# EasyEDA Pro project Marlin2SamplerWrapper.eprj

# Schematic Schematic1_2
Create Date: 2023-06-06; Page Name: P1; Project Name: Marlin2SamplerWrapper; Schematic Name: Schematic1_2; Update Date: 2023-06-06; Company: 嘉立创EDA; Page Size: A4; Version: V1.0
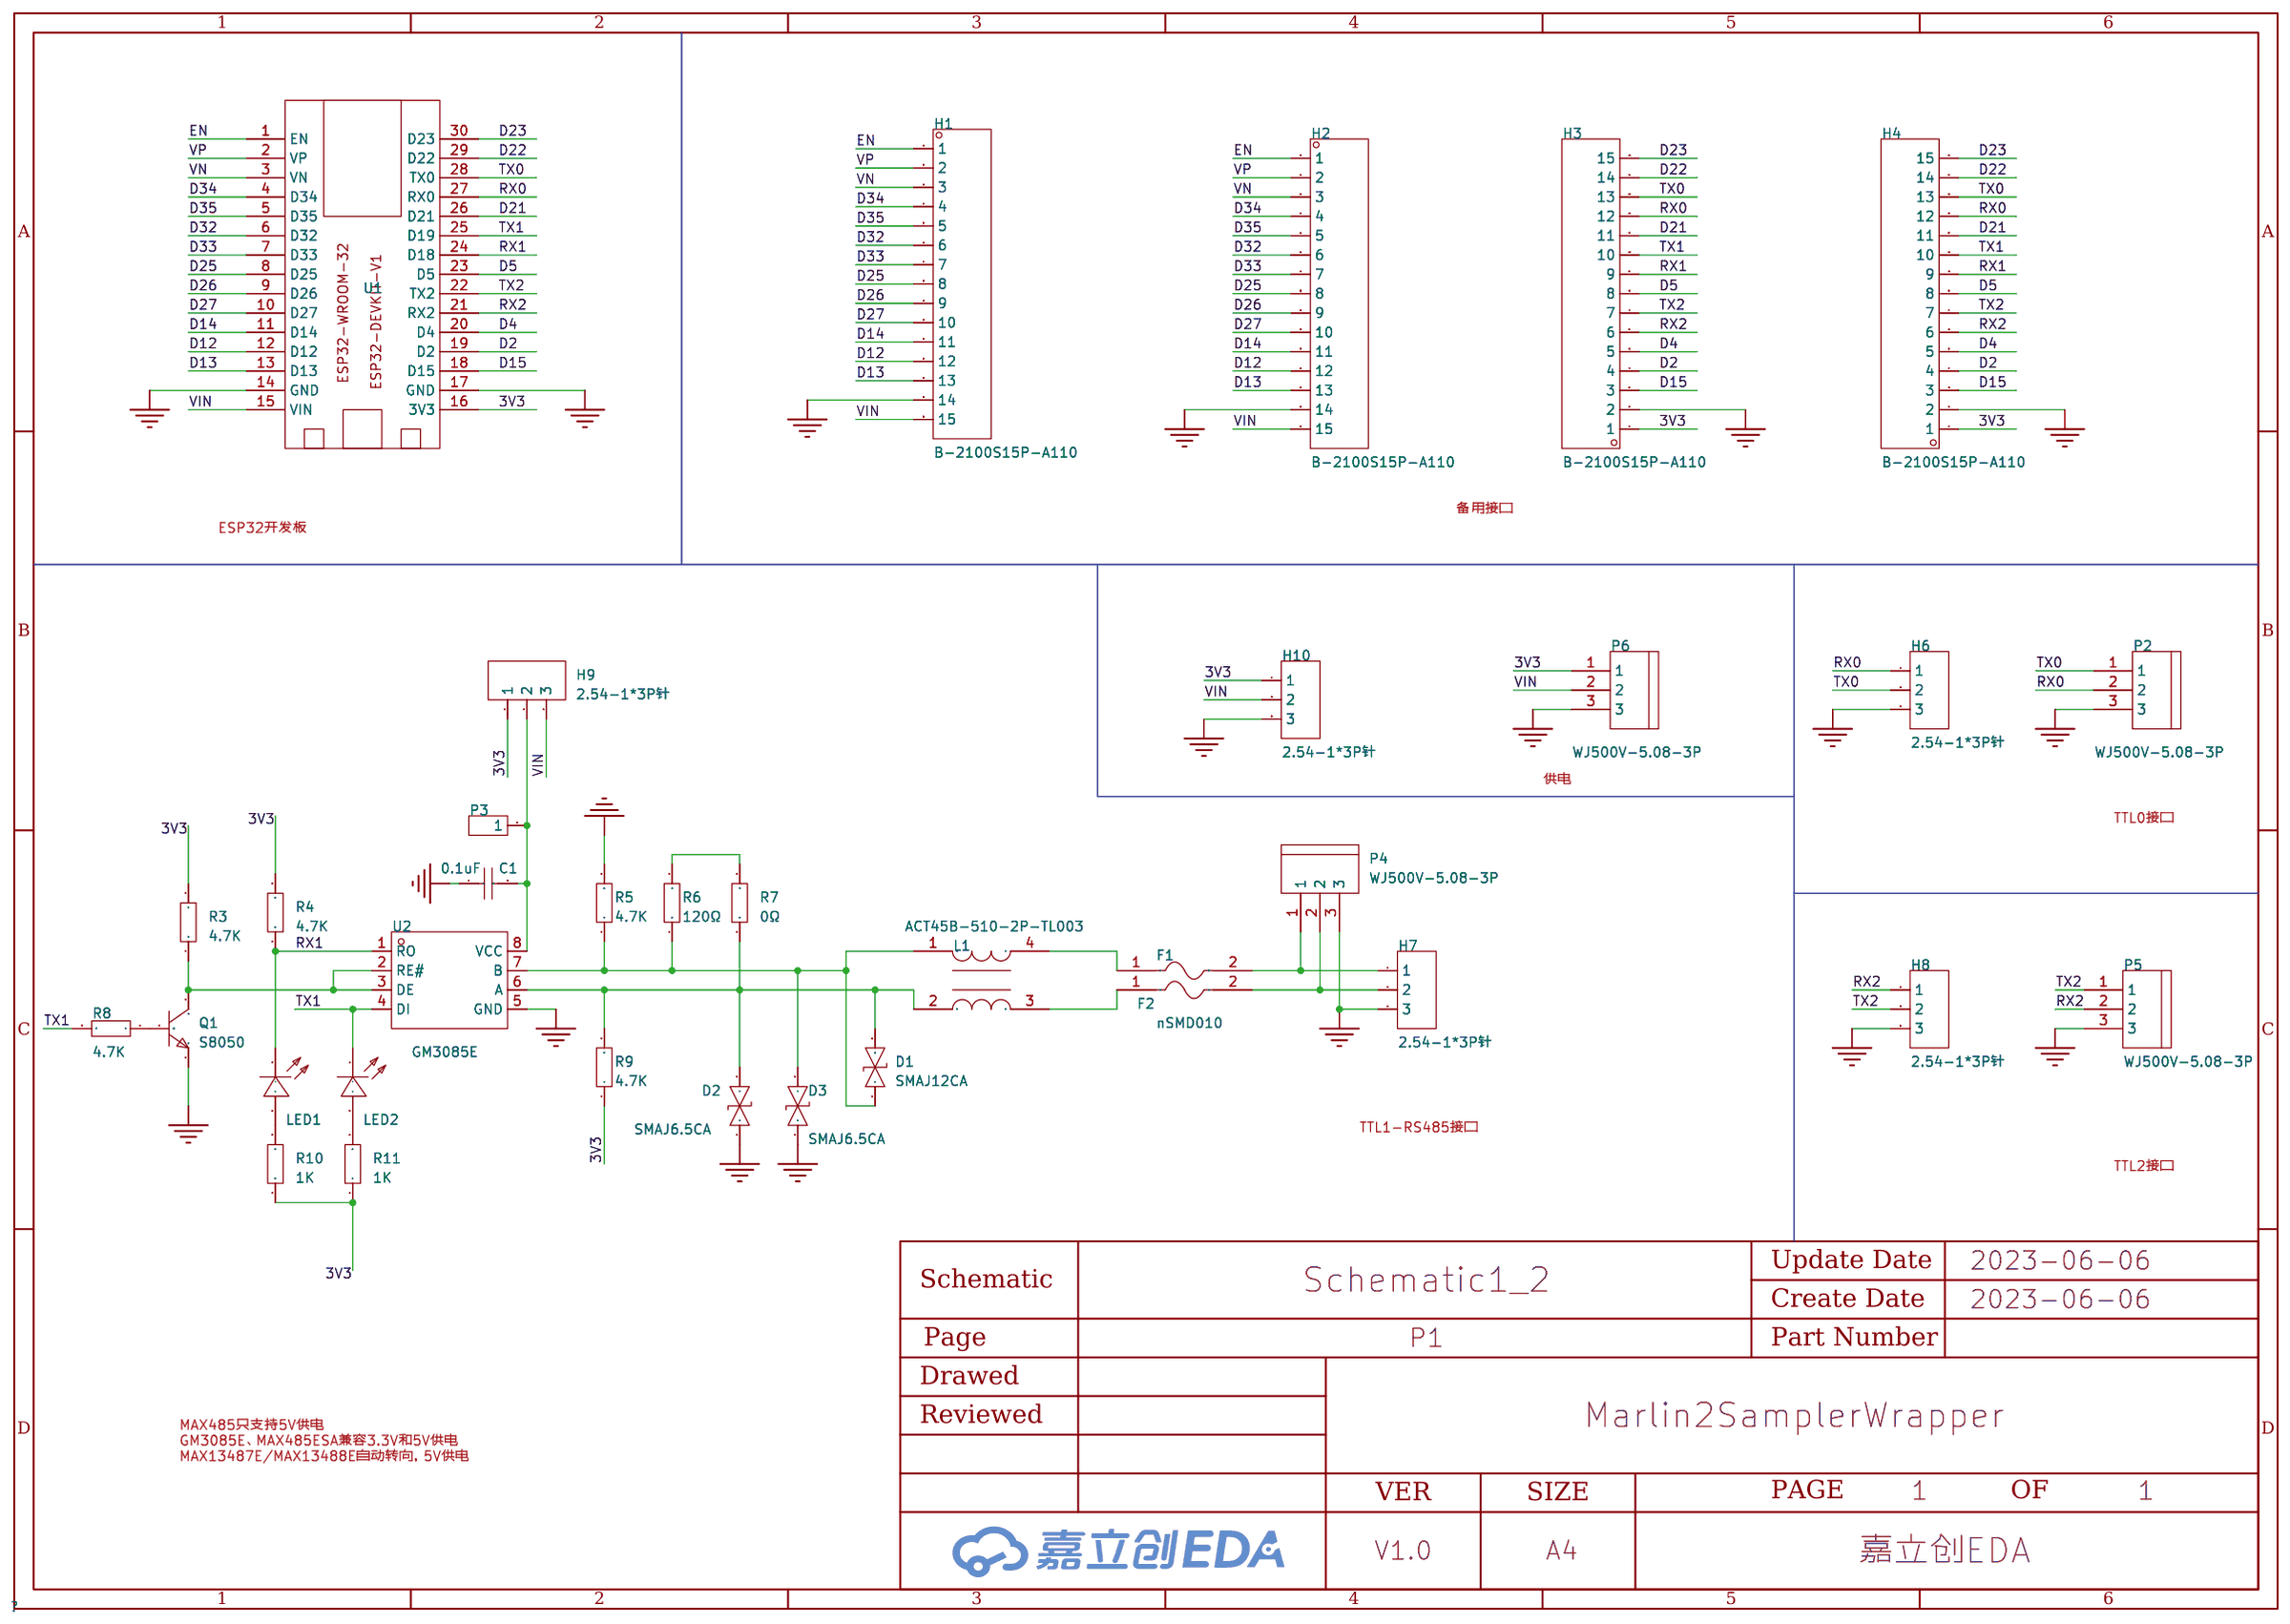
[diagram p0: schematic sheet]

## Parts
C1  0.1uF  [C0805]
D1  SMAJ12CA  [SMA_L4.4-W2.6-LS5.0-BI]
D2  SMAJ6.5CA  [SMA_L4.4-W2.6-LS5.0-BI]
D3  SMAJ6.5CA  [SMA_L4.4-W2.6-LS5.0-BI]
F1  nSMD010  [F1206]
F2  nSMD010  [F1206]
H1  B-2100S15P-A110  [HDR-TH_15P-P2.54-V-M]
H2  B-2100S15P-A110  [HDR-TH_15P-P2.54-V-M]
H3  B-2100S15P-A110  [HDR-TH_15P-P2.54-V-M]
H4  B-2100S15P-A110  [HDR-TH_15P-P2.54-V-M]
H6  2.54-1*3P针  [HDR-TH_3P-P2.54-V-M-1]
H7  2.54-1*3P针  [HDR-TH_3P-P2.54-V-M-1]
H8  2.54-1*3P针  [HDR-TH_3P-P2.54-V-M-1]
H9  2.54-1*3P针  [HDR-TH_3P-P2.54-V-M-1]
H10  2.54-1*3P针  [HDR-TH_3P-P2.54-V-M-1]
L1  ACT45B-510-2P-TL003  [IND-SMD_4P-L4.5-W3.2-TL]
LED1  NCD0805R1  [LED0805-RD_RED]
LED2  NCD0805R1  [LED0805-RD_RED]
P2  WJ500V-5.08-3P  [CONN-TH_3P-P5.00_WJ500V-5.08-3P]
P3  2.54-1*1P针  [HDR-TH_1P-P2.54-V-M]
P4  WJ500V-5.08-3P  [CONN-TH_3P-P5.00_WJ500V-5.08-3P]
P5  WJ500V-5.08-3P  [CONN-TH_3P-P5.00_WJ500V-5.08-3P]
P6  WJ500V-5.08-3P  [CONN-TH_3P-P5.00_WJ500V-5.08-3P]
Q1  S8050  [TO-92-3_L4.9-W3.7-P1.27-L]
R3  4.7K  [R0805]
R4  4.7K  [R0805]
R5  4.7K  [R0805]
R6  120Ω  [R0805]
R7  0Ω  [R0805]
R8  4.7K  [R0805]
R9  4.7K  [R0805]
R10  1K  [R0805]
R11  1K  [R0805]
U1  -  [ESP32-devkit-30pin]
U2  GM3085E  [SOP-8_L4.9-W3.9-P1.27-LS6.0-BL]

## Library data of the parts
C1 = CL21A106KOQNNNE: 容值:10uF;精度:±10%;额定电压:16V;材质(温度系数):X5R;; LCSC Part Name: 10uF ±10% 16V; Supplier Part: C1713; Manufacturer: SAMSUNG(三星); Supplier Footprint: 0805; JLCPCB Part Class: Extended Part; Datasheet: https://atta.szlcsc.com/upload/public/pdf/source/20160103/1457707694240.pdf; Supplier: LCSC; Tolerance: ±10%; Voltage Rated: 16V; Temperature Coefficient: X5R
D1 = SMAJ12CA_C110042: 极性:双向;反向截止电压(Vrwm):12V;击穿电压:13.3V;最大钳位电压:19.9V;; LCSC Part Name: 双向TVS 12V截止 20.1A峰值脉冲; Supplier Part: C110042; Manufacturer: MDD; Supplier Footprint: SMA(DO-214AC); JLCPCB Part Class: Extended Part; Datasheet: https://atta.szlcsc.com/upload/public/pdf/source/20230314/4319D8044EE29783A53F6AC60595AA71.pdf; Supplier: LCSC; Polarity: 双向; Reverse Stand-Off Voltage (Vrwm): 12V; Breakdown Voltage: 13.3V; Peak Pulse Current (Ipp)@10/1000μs: 20.1A; Maximum Clamping Voltage: 19.9V
D2 D3 = SMAJ6.5CA_C192922: 极性:双向;反向截止电压(Vrwm):6.5V;击穿电压:7.22V;最大钳位电压:11.2V;; LCSC Part Name: 双向 Vrwm:6.5V; Supplier Part: C192922; Manufacturer: 晶导微电子; Supplier Footprint: SMA(DO-214AC); JLCPCB Part Class: Extended Part; Datasheet: https://atta.szlcsc.com/upload/public/pdf/source/20180521/C192922_DE14EFAD4C80F9427B705159DBAF7B10.pdf; Supplier: LCSC; Polarity: 双向; Reverse Stand-Off Voltage (Vrwm): 6.5V; Breakdown Voltage: 7.22V; Peak Pulse Current (Ipp)@10/1000μs: 35.7A; Maximum Clamping Voltage: 11.2V
F1 F2 = nSMD010: 最大电压:60V;保持电流:100mA;最大电流:100A;跳闸电流:250mA;; LCSC Part Name: 0.1A  60V 自恢复保险丝; Supplier Part: C70065; Manufacturer: 台湾陆海; Supplier Footprint: 1206; JLCPCB Part Class: Extended Part; Datasheet: https://atta.szlcsc.com/upload/public/pdf/source/20160331/1459396375985.pdf; Supplier: LCSC; Operating Voltage (Max): 60V; Hold Current: 100mA; Current Rating (Max): 100A; Trip Current: 250mA
H1-H4 = B-2100S15P-A110: 排数:单排;总PIN位数:15;间距:2.54mm;插针结构:1x15P;行距:-;安装类型:直插;圆针/方针:-;额定电流:-;额定电压:-;配合针长度:6mm;塑高:2.54mm;端接针长度:3mm;触头材质:黄铜;触头镀层:-;工作温度范围:-40℃~+105℃;颜色:黑色;; LCSC Part Name: 2.54mm 1x15P 直插; Supplier Part: C124373; Manufacturer: Ckmtw(灿科盟); Supplier Footprint: 插件,P=2.54mm; JLCPCB Part Class: Extended Part; Datasheet: https://atta.szlcsc.com/upload/public/pdf/source/20170821/C124373_1503303304753901525.pdf; Supplier: LCSC; Number of Rows: 单排; Number of Pins: 15; Pitch: 2.54mm; Pin Structure: 1x15P; Mounting Type: 直插; Length of Mating Pin: 6mm; Insulation Height: 2.54mm; Length of End Connection Pin: 3mm; Contact Material: 黄铜; Operating Temperature Range: -40℃~+105℃; Color: 黑色
H6-H10 = 2.54-1*3P针: 排数:单排;总PIN位数:3;间距:2.54mm;插针结构:1x3P;行距:-;安装类型:直插;圆针/方针:方针;额定电流:3A;额定电压:-;配合针长度:-;塑高:-;端接针长度:-;触头材质:-;触头镀层:-;工作温度范围:-40℃~+105℃;颜色:黑色;; LCSC Part Name: 2.54mm 1x3P 直插 方针; Supplier Part: C49257; Manufacturer: BOOMELE(博穆精密); Supplier Footprint: 插件,P=2.54mm; JLCPCB Part Class: Extended Part; Datasheet: https://atta.szlcsc.com/upload/public/pdf/source/20221018/3E9408392E35E6F57A28985E5F7BF5C9.pdf; Supplier: LCSC; Number of Rows: 单排; Number of Pins: 3; Pitch: 2.54mm; Pin Structure: 1x3P; Mounting Type: 直插; Circluar Pins/Square Pins: 方针; Current Rating (Max): 3A; Operating Temperature Range: -40℃~+105℃; Color: 黑色
L1 = ACT45B-510-2P-TL003: 线路数:2;阻抗 @ 频率:2.8kΩ@10MHz;电感 @ 频率:51uH@100kHz;直流电阻(DCR):1Ω;; LCSC Part Name: 两路 4532共模滤波器 阻抗2.8kΩ@10MHz; Supplier Part: C76584; Manufacturer: TDK; Supplier Footprint: 4532; JLCPCB Part Class: Extended Part; Datasheet: https://atta.szlcsc.com/upload/public/pdf/source/20160918/1474166842057.pdf; Supplier: LCSC; Number of Lines: 2; Impedance @ Frequency: 2.8kΩ@10MHz; Inductance @ Frequency: 51uH@100kHz; Current Rating: 200mA; DC Resistance (DCR): 1Ω; Voltage Rating - DC: 50V; Operating Temperature: -40℃~+150℃; Withstanding Voltage: 250V@2Secs
LED1 LED2 = NCD0805R1: 发光颜色:红灯;; LCSC Part Name: 红灯; Supplier Part: C84256; Manufacturer: 国星光电; Supplier Footprint: 0805; JLCPCB Part Class: Basic Part; Datasheet: https://atta.szlcsc.com/upload/public/pdf/source/20200820/C84256_F0A75A43B3EAD75808600A0514C76B99.pdf; Supplier: LCSC; Emitted Color: 红灯
P2 P4-P6 = WJ500V-5.08-3P: 间距:5.08mm;结构:1x3P;排数:1;每排PIN数:3;安装方式:直针;额定电流:18A;额定电压:250V;线规 - AWG:14~30;线规 - mm2:2.5;工作温度范围:-40℃~+105℃;颜色:绿色;; LCSC Part Name: 5.08mm 1x3P 排数:1 每排P数:3 直针 可拼接; Supplier Part: C72334; Manufacturer: KANGNEX(康奈克斯电气); Supplier Footprint: 插件,P=5.08mm; JLCPCB Part Class: Extended Part; Datasheet: https://atta.szlcsc.com/upload/public/pdf/source/20191225/C72334_8A5EF831D67650233B6B1E3F2BC06274.pdf; Supplier: LCSC; Pitch: 5.08mm; Structure: 1x3P; Number of Rows: 1; Number of PINs Per Row: 3; Mounting Style: 直针; Current Rating (Max): 18A; Voltage Rating (Max): 250V; Wire Gauge - AWG: 14~30; Wire Gauge - mm2: 2.5; Operating Temperature Range: -40℃~+105℃; Color: 绿色
P3 = 2.54-1*1P针: 排数:单排;总PIN位数:1;间距:-;插针结构:-;行距:-;安装类型:直插;圆针/方针:-;额定电流:-;额定电压:-;配合针长度:-;塑高:-;触头材质:-;触头镀层:-;颜色:黑色;; LCSC Part Name: 直插; Supplier Part: C81276; Manufacturer: BOOMELE(博穆精密); Supplier Footprint: 插件,P=2.54mm; JLCPCB Part Class: Extended Part; Datasheet: https://atta.szlcsc.com/upload/public/pdf/source/20221018/3E9408392E35E6F57A28985E5F7BF5C9.pdf; Supplier: LCSC; Number of Rows: 单排; Number of Pins: 1; Mounting Type: 直插; Color: 黑色
Q1 = S8050_C8327: 晶体管类型:NPN;集射极击穿电压(Vceo):25V;集电极电流(Ic):500mA;功率(Pd):625mW;集电极截止电流(Icbo):100nA;集电极-发射极饱和电压(VCE(sat)@Ic,Ib):600mV@500mA,50mA;直流电流增益(hFE@Ic,Vce):160@50mA,1V;特征频率(fT):150MHz;工作温度:+150℃@(Tj);; LCSC Part Name: NPN 25V 500mA; Supplier Part: C8327; Manufacturer: CJ(江苏长电/长晶); Supplier Footprint: TO-92-3; JLCPCB Part Class: Extended Part; Datasheet: https://atta.szlcsc.com/upload/public/pdf/source/20130521/1457706603998.pdf; Supplier: LCSC; Transistor Type: NPN; Collector-Emitter Breakdown Voltage (Vceo): 25V; Collector Current (Ic): 500mA; Power Dissipation (Pd): 625mW; Collector Cut-Off Current (Icbo): 100nA; Collector-Emitter Saturation Voltage (VCE(sat)@Ic,Ib): 600mV@500mA,50mA; DC Current Gain (hFE@Ic,Vce): 160@50mA,1V; Transition Frequency (fT): 150MHz; Operating Temperature: +150℃@(Tj)
R3 R4 R8 R10 R11 = Res_0805: Supplier Footprint: 0805
R5 R6 R9 = 0805W8F1200T5E: 电阻类型:厚膜电阻;阻值:120Ω;精度:±1%;功率:125mW;; LCSC Part Name: 120Ω ±1% 125mW; Supplier Part: C17437; Manufacturer: UNI-ROYAL(厚声); Supplier Footprint: 0805; JLCPCB Part Class: Basic Part; Datasheet: https://atta.szlcsc.com/upload/public/pdf/source/20200306/C422600_1E6D84923E4A46A82E41ADD87F860B5C.pdf; Supplier: LCSC; Type: 厚膜电阻; Tolerance: ±1%; Power(Watts): 125mW; Temperature Coefficient: ±100ppm/℃; Overload Voltage (Max): 150V; Operating Temperature Range: -55℃~+155℃
R7 = 0805W8F0000T5E: 电阻类型:厚膜电阻;阻值:0Ω;精度:±1%;功率:125mW;; LCSC Part Name: 0Ω ±1% 125mW; Supplier Part: C17477; Manufacturer: UNI-ROYAL(厚声); Supplier Footprint: 0805; JLCPCB Part Class: Basic Part; Datasheet: https://atta.szlcsc.com/upload/public/pdf/source/20200306/C422600_1E6D84923E4A46A82E41ADD87F860B5C.pdf; Supplier: LCSC; Type: 厚膜电阻; Tolerance: ±1%; Power(Watts): 125mW; Temperature Coefficient: ±800ppm/℃; Overload Voltage (Max): 150V; Operating Temperature Range: -55℃~+155℃
U1 = ESP32-DEVKIT-V1(30pin): 淘宝上卖的ESP32开发板，大多数是30脚的这一款
U2 = GM3085E: 类型:收发器;驱动器/接收器:1/1;数据速率:1Mbps;; LCSC Part Name: 3V~5.5V供电 1Mbps 收发器; Supplier Part: C269864; Manufacturer: GATEMODE(捷茂微); Supplier Footprint: SOP-8; JLCPCB Part Class: Extended Part; Datasheet: https://atta.szlcsc.com/upload/public/pdf/source/20180903/C269864_EB56873CBCC7049A9A506FCD98F69E64.pdf; Supplier: LCSC; Types: 收发器; Driver/receiver: 1/1; Data Rate: 1Mbps; Supply Voltage: 3V~5.5V

## Nets
3V3: H3.1 H4.1 H9.1 H10.1 P6.1 R3.2 R4.2 R9.1 R10.1 R11.1 U1.16(3V3)
GND: C1.1 D2.1(K) D3.1(K) H1.14 H2.14 H3.2 H4.2 H6.3 H7.3 H8.3 H10.3 P2.3 P4.3 P5.3 P6.3 Q1.1(E) R5.2 U1.14(GND) U1.17(GND) U2.5(GND)
VIN: H1.15 H2.15 H9.3 H10.2 P6.2 U1.15(VIN)
D2: H3.4 H4.4 U1.19(D2)
D4: H3.5 H4.5 U1.20(D4)
D5: H3.8 H4.8 U1.23(D5)
D12: H1.12 H2.12 U1.12(D12)
D13: H1.13 H2.13 U1.13(D13)
D14: H1.11 H2.11 U1.11(D14)
D15: H3.3 H4.3 U1.18(D15)
D21: H3.11 H4.11 U1.26(D21)
D22: H3.14 H4.14 U1.29(D22)
D23: H3.15 H4.15 U1.30(D23)
D25: H1.8 H2.8 U1.8(D25)
D26: H1.9 H2.9 U1.9(D26)
D27: H1.10 H2.10 U1.10(D27)
D32: H1.6 H2.6 U1.6(D32)
D33: H1.7 H2.7 U1.7(D33)
D34: H1.4 H2.4 U1.4(D34)
D35: H1.5 H2.5 U1.5(D35)
EN: H1.1 H2.1 U1.1(EN)
RX0: H3.12 H4.12 H6.1 P2.2 U1.27(RX0)
RX1: H3.9 H4.9 LED1.1(-) R4.1 U1.24(D18) U2.1(RO)
RX2: H3.6 H4.6 H8.1 P5.2 U1.21(RX2)
TX0: H3.13 H4.13 H6.2 P2.1 U1.28(TX0)
TX1: H3.10 H4.10 LED2.1(-) R8.2 U1.25(D19) U2.4(DI)
TX2: H3.7 H4.7 H8.2 P5.1 U1.22(TX2)
VN: H1.3 H2.3 U1.3(VN)
VP: H1.2 H2.2 U1.2(VP)
$1N2909: Q1.3(C) R3.1 U2.2(RE#) U2.3(DE)
$1N4480: Q1.2(B) R8.1
$1N4547: R6.2 R7.2
$1N4912: F2.2 H7.2 P4.2
$1N4918: F1.2 H7.1 P4.1
$1N5168: C1.2 H9.2 P3.1 U2.8(VCC)
$1N5254: D1.1 D3.2(A) L1.1 R5.1 R6.1 U2.7(B)
$1N5258: D1.2 D2.2(A) L1.2 R7.1 R9.2 U2.6(A)
$1N5262: F1.1 L1.4
$1N5266: F2.1 L1.3
$1N5324: LED2.2(+) R11.2
$1N5326: LED1.2(+) R10.2

## Notes on the sheet
- 备用接口
- ESP32开发板
- 供电
- TTL0接口
- TTL1-RS485接口
- TTL2接口
- MAX485只支持5V供电
  GM3085E、MAX485ESA兼容3.3V和5V供电
  MAX13487E/MAX13488E自动转向，5V供电

# Schematic Schematic2_1
Create Date: 2023-06-06; Page Name: P1; Project Name: Marlin2SamplerWrapper; Schematic Name: Schematic2; Update Date: 2023-06-06; Company: 嘉立创EDA; Page Size: A4; Version: V1.0
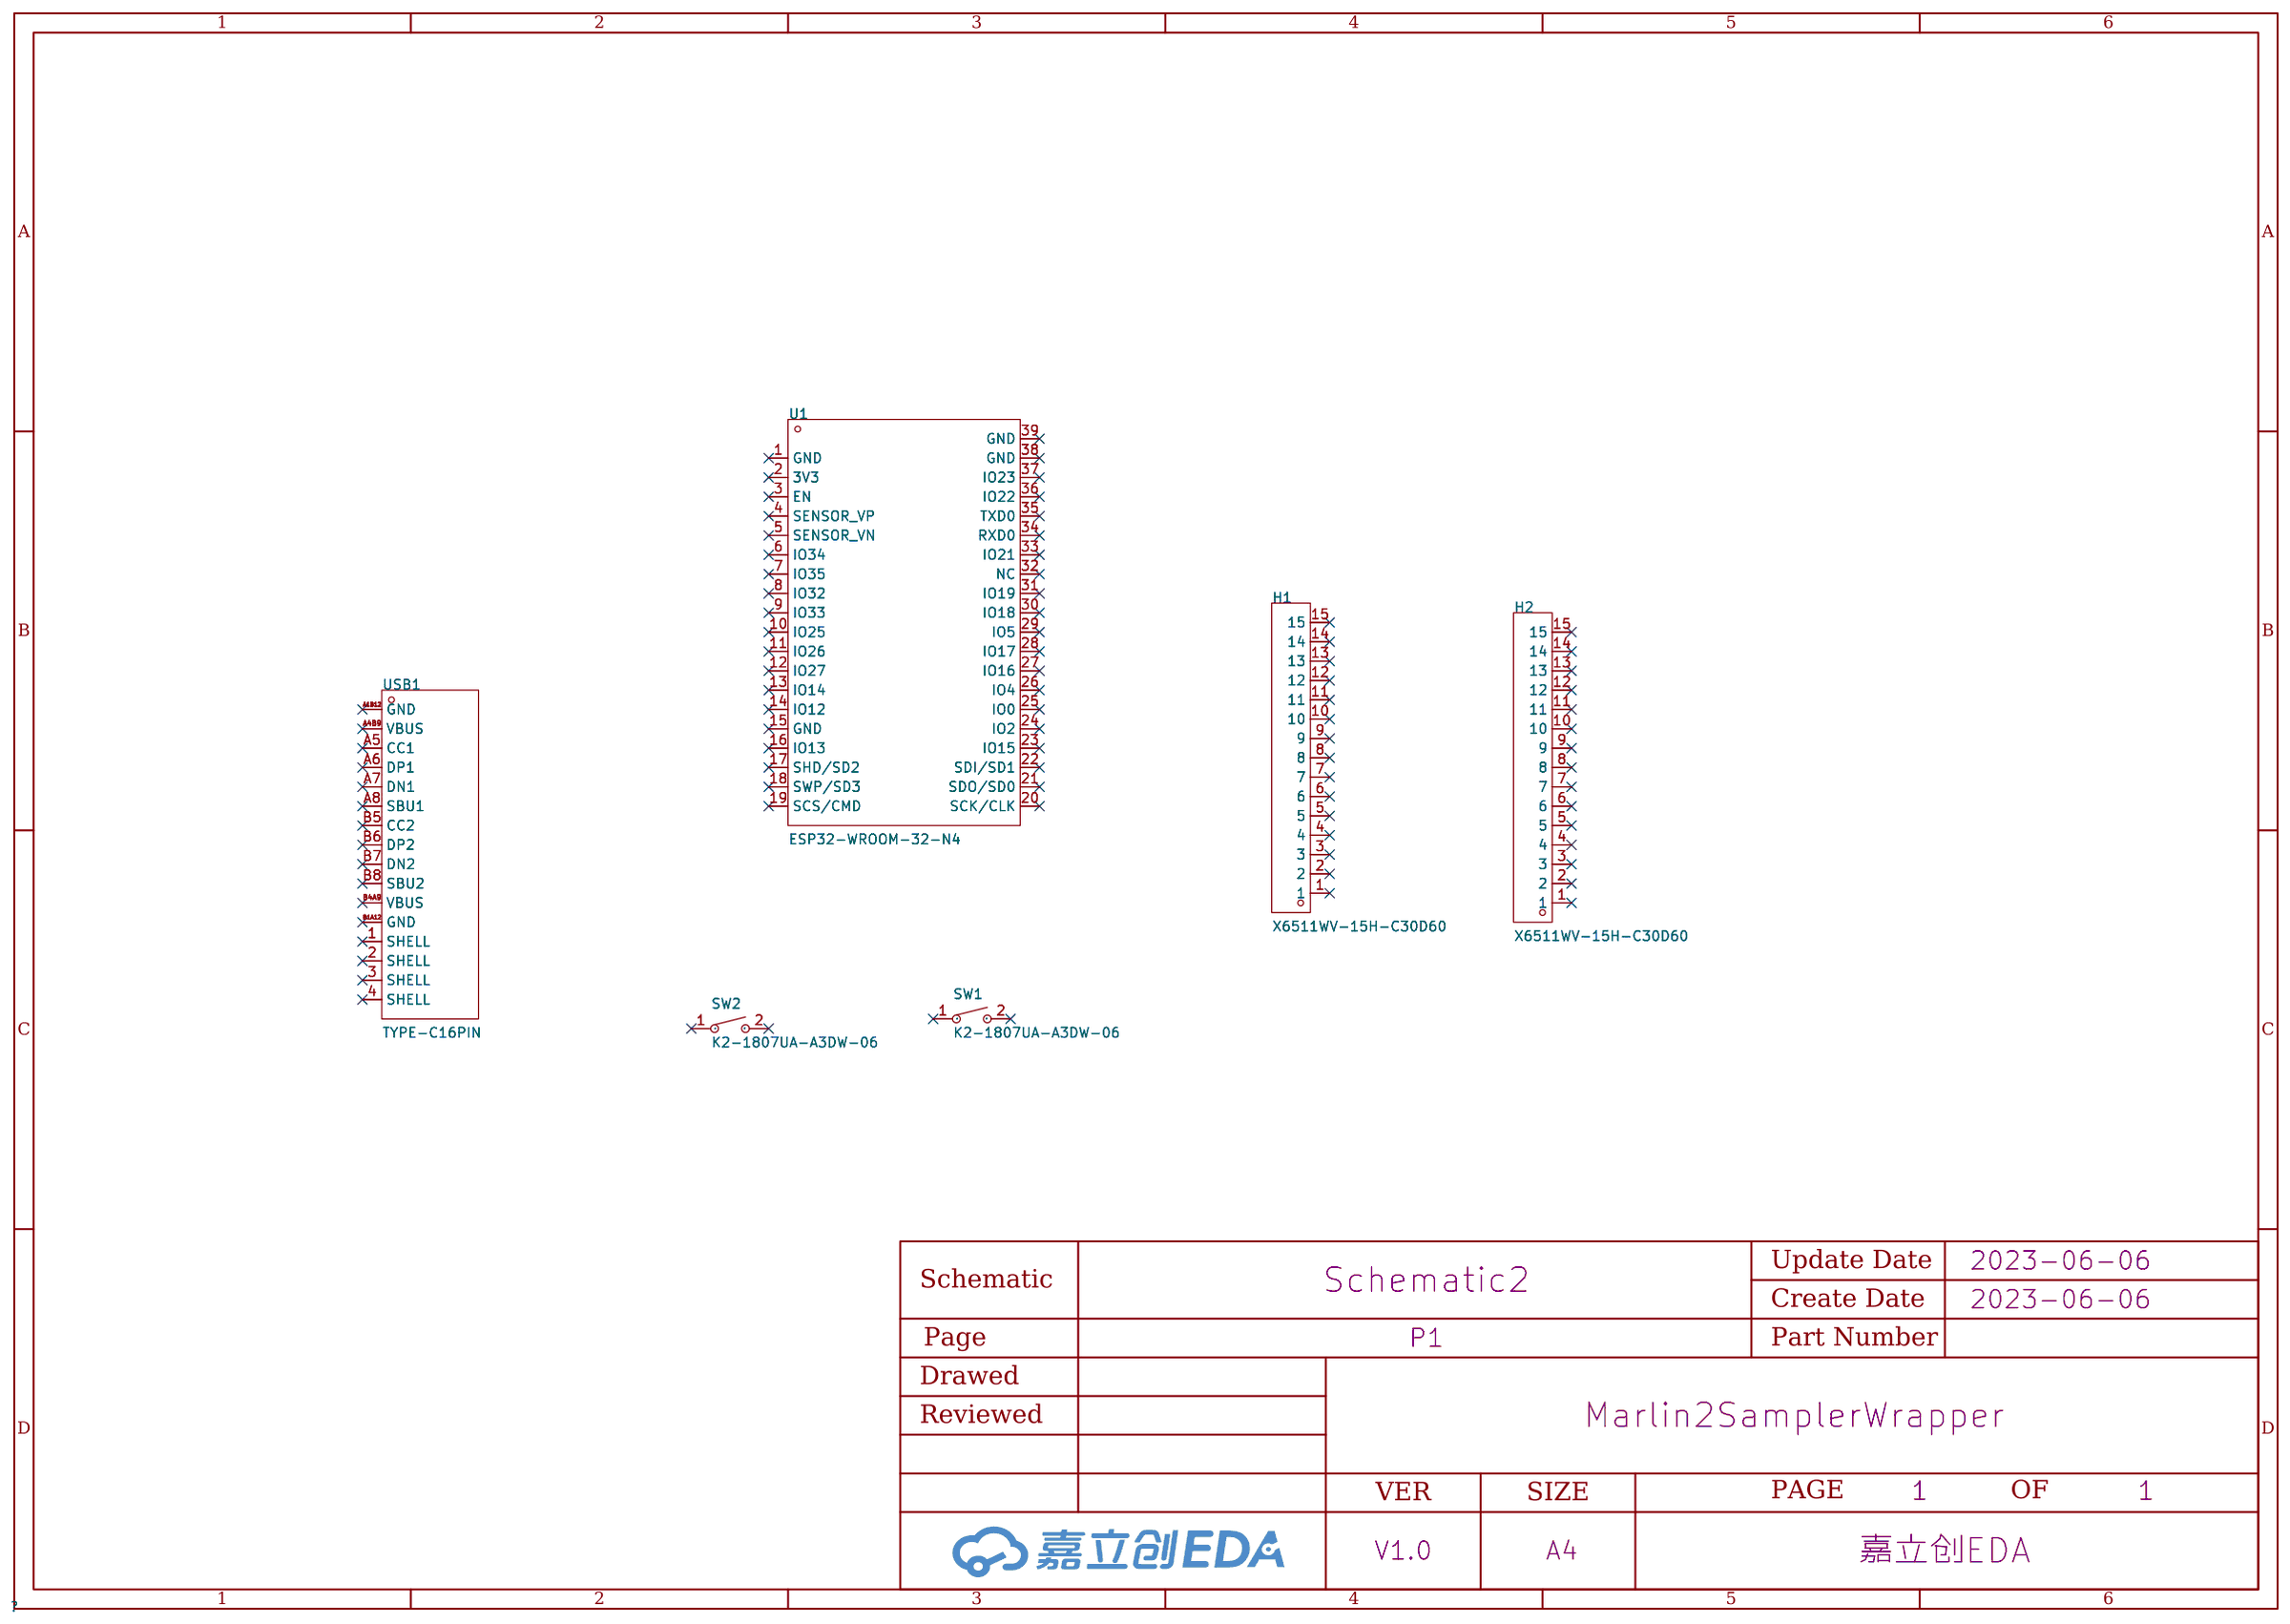
[diagram p1: schematic sheet]

## Parts
H1  X6511WV-15H-C30D60  [HDR-TH_15P-P2.54-V-M]
H2  X6511WV-15H-C30D60  [HDR-TH_15P-P2.54-V-M]
SW1  K2-1807UA-A3DW-06  [KEY-SMD_L4.0-W2.9-L]
SW2  K2-1807UA-A3DW-06  [KEY-SMD_L4.0-W2.9-L]
U1  ESP32-WROOM-32-N4  [WIFIM-SMD_ESP32-WROOM-32-N4]
USB1  TYPE-C16PIN  [USB-C-SMD_TYPE-C16PIN]

## Library data of the parts
H1 H2 = X6511WV-15H-C30D60: 排数:单排;总PIN位数:15;间距:2.54mm;插针结构:1x15P;行距:-;安装类型:直插;圆针/方针:方针;额定电流:3A;额定电压:250V;配合针长度:6mm;塑高:2.5mm;端接针长度:3mm;触头材质:黄铜;触头镀层:金;工作温度范围:-40℃~+105℃;焊接温度(最大值):260℃;颜色:黑色;; LCSC Part Name: 2.54mm1x15P直插方针; Supplier Part: C725947; Manufacturer: XKBConnectivity(中国星坤); Supplier Footprint: 插件,P=2.54mm; JLCPCB Part Class: ExtendedPart; Datasheet: https://atta.szlcsc.com/upload/public/pdf/source/20211009/D19569EFFEB9776B42364DF7D41FD96A.pdf; Supplier: LCSC; Number of Rows: 单排; Number of Pins: 15; Pitch: 2.54mm; Pin Structure: 1x15P; Mounting Type: 直插; Circluar Pins/Square Pins: 方针; Current Rating (Max): 3A; Voltage Rating (Max): 250V; Length of Mating Pin: 6mm; Insulation Height: 2.5mm; Length of End Connection Pin: 3mm; Contact Material: 黄铜; Contact Plating: 金; Operating Temperature Range: -40℃~+105℃; Welding Temperature (Max): 260℃; Color: 黑色
SW1 SW2 = K2-1807UA-A3DW-06: 触点电流:50mA;额定电压(DC):12V;绝缘电阻:100MΩ;电路结构:单刀单掷;安装方式:立贴;按钮形状:圆形按钮;带灯:-;作用力:180gf@±30gf;机械寿命:100000;工作温度:-25℃~+85℃;开关长度:4mm;开关宽度:2.9mm;开关高度:2mm;; LCSC Part Name: 3x4x2.0包脚U型; Supplier Part: C502308; Manufacturer: 韩国韩荣; Supplier Footprint: SMD; JLCPCB Part Class: ExtendedPart; Datasheet: https://atta.szlcsc.com/upload/public/pdf/source/20200331/C502307_15C9B93D30C058C4B615B227891823AA.pdf; Supplier: LCSC; Contact Current: 50mA; Voltage Rating (DC): 12V; Insulation Resistance: 100MΩ; Circuit: 单刀单掷; Mounting Sytle: 立贴; Actuator Style: 圆形按钮; Operating Force: 180gf@±30gf; Mechanical Life: 100000; Operating Temperature: -25℃~+85℃; Switch Length: 4mm; Switch Width: 2.9mm; Switch Height: 2mm
U1 = ESP32-WROOM-32-N4: WiFi+蓝牙4.2+双核CPU,ESP32; Supplier Part: C82899; Manufacturer: ESPRESSIF(乐鑫); Supplier Footprint: WIFI无线Module; JLCPCB Part Class: ExtendedPart; Datasheet: https://atta.szlcsc.com/upload/public/pdf/source/20210719/C82899_2D52724B6FAFABC419BCF308C5944296.pdf; Supplier: LCSC
USB1 = TYPE-C16PIN: 连接器类型:Type-C;标准:-;公母:母座;触点数量:16;端口数量:1;安装方式:卧贴;额定电流-电源:3A;工作温度范围:-40℃~+85℃;; LCSC Part Name: Type-C母座卧贴快充闪充停产; Supplier Part: C393939; Manufacturer: SHOUHAN(首韩); Supplier Footprint: SMD; JLCPCB Part Class: ExtendedPart; Datasheet: https://atta.szlcsc.com/upload/public/pdf/source/20190521/C393939_7B9043D4CF1026AF443AB60D91FBCD5C.pdf; Supplier: LCSC; Connector Type: Type-C; Gender: 母座; Number of Contacts: 16; Number of Ports: 1; Mounting Style: 卧贴; Current Rating - Power (Max): 3A; Operating Temperature Range: -40℃~+85℃

## Nets

Not connected (* = marked no-connect by the designer): H1 1* 2* 3* 4* 5* 6* 7* 8* 9* 10* 11* 12* 13* 14* 15*; H2 1* 2* 3* 4* 5* 6* 7* 8* 9* 10* 11* 12* 13* 14* 15*; SW1 1* 2*; SW2 1* 2*; U1 1(GND)* 2(3V3)* 3(EN)* 4(SENSOR_VP)* 5(SENSOR_VN)* 6(IO34)* 7(IO35)* 8(IO32)* 9(IO33)* 10(IO25)* 11(IO26)* 12(IO27)* 13(IO14)* 14(IO12)* 15(GND)* 16(IO13)* 17(SHD/SD2)* 18(SWP/SD3)* 19(SCS/CMD)* 20(SCK/CLK)* 21(SDO/SD0)* 22(SDI/SD1)* 23(IO15)* 24(IO2)* 25(IO0)* 26(IO4)* 27(IO16)* 28(IO17)* 29(IO5)* 30(IO18)* 31(IO19)* 32(NC)* 33(IO21)* 34(RXD0)* 35(TXD0)* 36(IO22)* 37(IO23)* 38(GND)* 39(GND)*; USB1 1(SHELL)* 2(SHELL)* 3(SHELL)* 4(SHELL)* A1B12(GND)* A4B9(VBUS)* A5(CC1)* A6(DP1)* A7(DN1)* A8(SBU1)* B1A12(GND)* B4A9(VBUS)* B5(CC2)* B6(DP2)* B7(DN2)* B8(SBU2)*

# Board PCB11
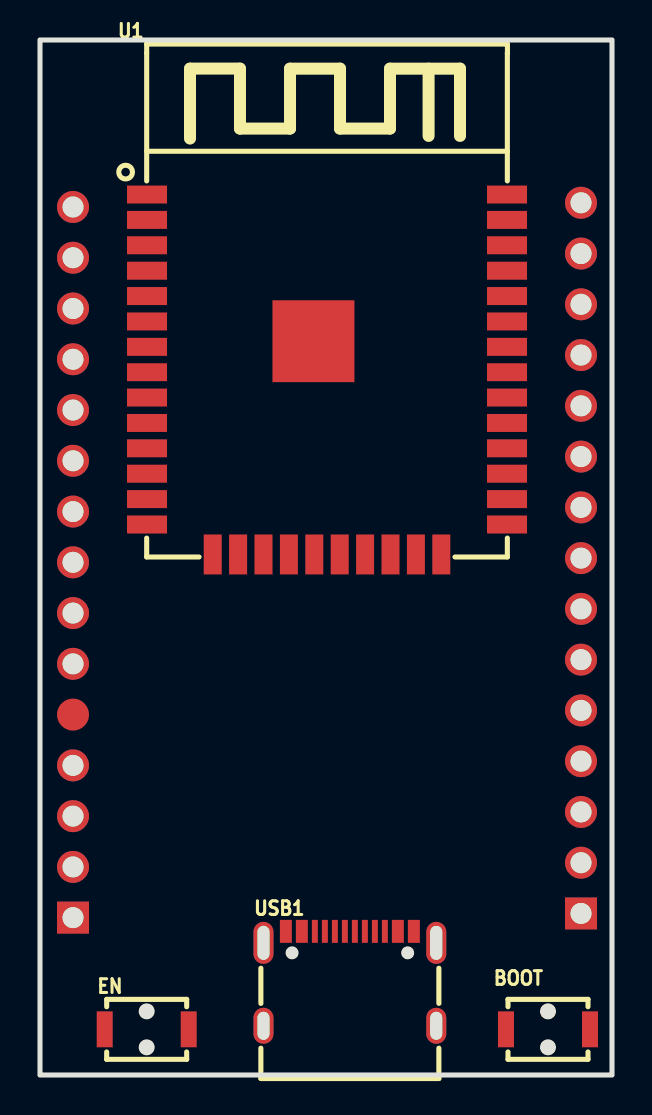
[diagram p2: board, top side]
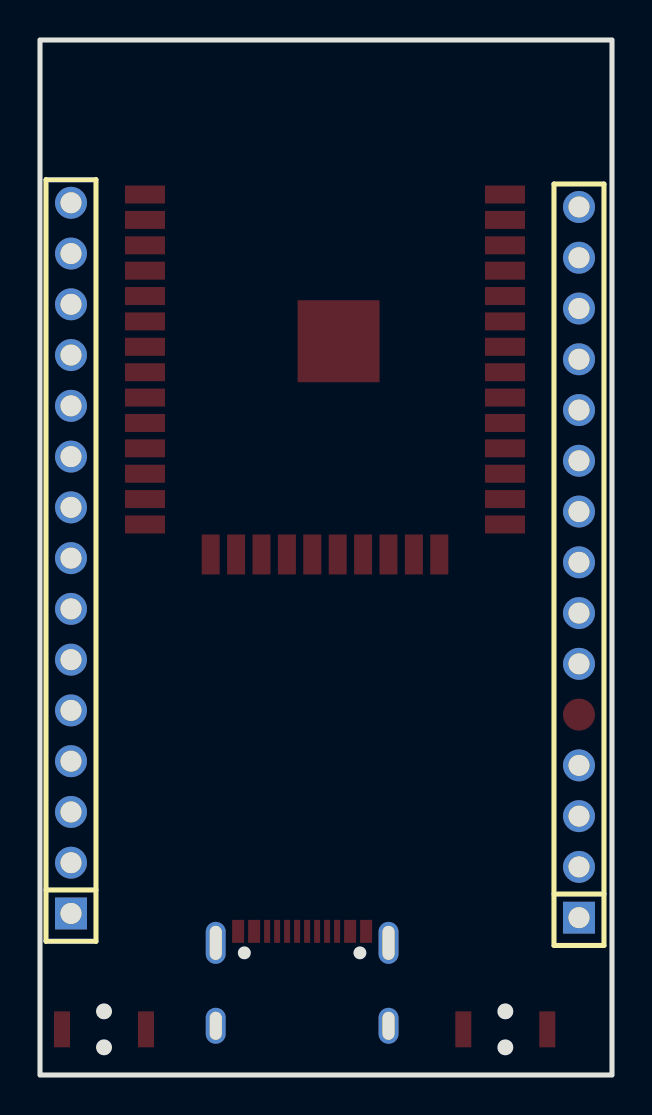
[diagram p3: board, bottom side, seen from below]

Outline 28.6 x 51.79 mm; copper layers: Top Layer, Bottom Layer. Coordinates in mm from the lower left corner of the outline.
Outline path: rectangle 0,51.79 28.6,0
Stack: Top Layer 0.035mm / Dielectric1 1.51mm FR4 er 4.5 / Bottom Layer 0.035mm

## Design rules (mm)
template: JLCPCB Capability(Two Layers Board)
spacing copperThickness1oz (default): track to track 0.102, other pairs 0.152 to 0.3
spacing copperThickness2oz: track to track 0.203, other pairs 0.152 to 0.3
track width copperThickness1oz (default): min 0.127, default 0.254, max 2.54
track width copperThickness2oz: min 0.203, default 0.254, max 2.54
differential pair differentialPair (default): width min 0.127, default 0.254, max 2.54; gap min 0.152, default 0.152
via viaSize (default): diameter min 0.5, default 0.61, max 10; hole min 0.3, default 0.305, max 6.3

## Placement (name value [footprint] x y rotation side)
BOOT  -  [KEY-SMD_L4.0-W2.9-L]  25.4 2.29 0 top
EN  -  [KEY-SMD_L4.0-W2.9-L]  5.33 2.29 0 top
H1  X6511WV-15H-C30D60  [hdr-th_15p-p2.54-v-m]  1.65 25.65 90 bottom
H2  X6511WV-15H-C30D60  [HDR-TH_15P-P2.54-V-M]  27.05 25.86 90 bottom
U1  ESP32-WROOM-32-N4  [WIFIM-SMD_ESP32-WROOM-32-N4]  14.35 35.05 0 top
USB1  TYPE-C16PIN  [USB-C-SMD_TYPE-C16PIN]  15.49 4.83 0 top

## Footprints (pads in the part's own frame, mm; a bottom-side part is the same pattern mirrored in y, then rotated)
HDR-TH_15P-P2.54-V-M
  rect 1.6x1.6 hole 1.05: 1(-17.78,0)
  round 1.6 hole 1.05: 2(-15.24,0) 3(-12.7,0) 4(-10.16,0) 5(-7.62,0) 6(-5.08,0) 7(-2.54,0) 8(0,0) 9(2.54,0) 10(5.08,0) 11(7.62,0) 12(10.16,0) 13(12.7,0) 14(15.24,0) 15(17.78,0)
hdr-th_15p-p2.54-v-m
  rect 1.6x1.6 hole 1.05: 1(-17.78,0)
  round 1.6 hole 1.05: 2(-15.24,0) 3(-12.7,0) 4(-10.16,0) 6(-5.08,0) 7(-2.54,0) 8(0,0) 9(2.54,0) 10(5.08,0) 11(7.62,0) 12(10.16,0) 13(12.7,0) 14(15.24,0) 15(17.78,0)
  round 1.6 smd far side: 5(-7.62,0)
KEY-SMD_L4.0-W2.9-L
  rect 0.8x1.8 smd: 1(-2.1,0) 2(2.1,0)
USB-C-SMD_TYPE-C16PIN
  oval 1x2.1 hole 0.6x1.7: 1(-4.32,1.788) 2(4.32,1.788)
  oval 1x1.8 hole 0.6x1.4: 3(-4.32,-2.362) 4(4.32,-2.362)
  rect 0.6x1.15 smd: A1B12(-3.2,2.362) A4B9(-2.4,2.362) B1A12(3.2,2.362) B4A9(2.4,2.362)
  rect 0.3x1.15 smd: A5(-1.25,2.362) A6(-0.25,2.362) A7(0.25,2.362) A8(-1.75,2.362) B5(1.75,2.362) B6(0.75,2.362) B7(-0.75,2.362) B8(1.25,2.362)
WIFIM-SMD_ESP32-WROOM-32-N4
  rect 2x0.9 smd: 1(-9,9.005) 2(-9,7.735) 3(-9,6.465) 4(-9,5.195) 5(-9,3.925) 6(-9,2.655) 7(-9,1.385) 8(-9,0.115) 9(-9,-1.155) 10(-9,-2.425) 11(-9,-3.695) 12(-9,-4.965) 13(-9,-6.235) 14(-9,-7.505) 25(9,-7.505) 26(9,-6.235) 27(9,-4.965) 28(9,-3.695) 29(9,-2.425) 30(9,-1.155) 31(9,0.115) 32(9,1.385) 33(9,2.655) 34(9,3.925) 35(9,5.195) 36(9,6.465) 37(9,7.735) 38(9,9.005)
  rect 0.9x2 smd: 15(-5.715,-9.005) 16(-4.445,-9.005) 17(-3.175,-9.005) 18(-1.905,-9.005) 19(-0.635,-9.005) 20(0.635,-9.005) 21(1.905,-9.005) 22(3.175,-9.005) 23(4.445,-9.005) 24(5.715,-9.005)
  rect 4.1x4.1 smd: 39(-0.68,1.665)

## Nets
As in the schematic.

Pads without a net: BOOT 1 2; EN 1 2; H1 1 2 3 4 5 6 7 8 9 10 11 12 13 14 15; H2 1 2 3 4 5 6 7 8 9 10 11 12 13 14 15; U1 1 2 3 4 5 6 7 8 9 10 11 12 13 14 15 16 17 18 19 20 21 22 23 24 25 26 27 28 29 30 31 32 33 34 35 36 37 38 39; USB1 1 2 3 4 A1B12 A4B9 A5 A6 A7 A8 B1A12 B4A9 B5 B6 B7 B8

# Board PCB1_2
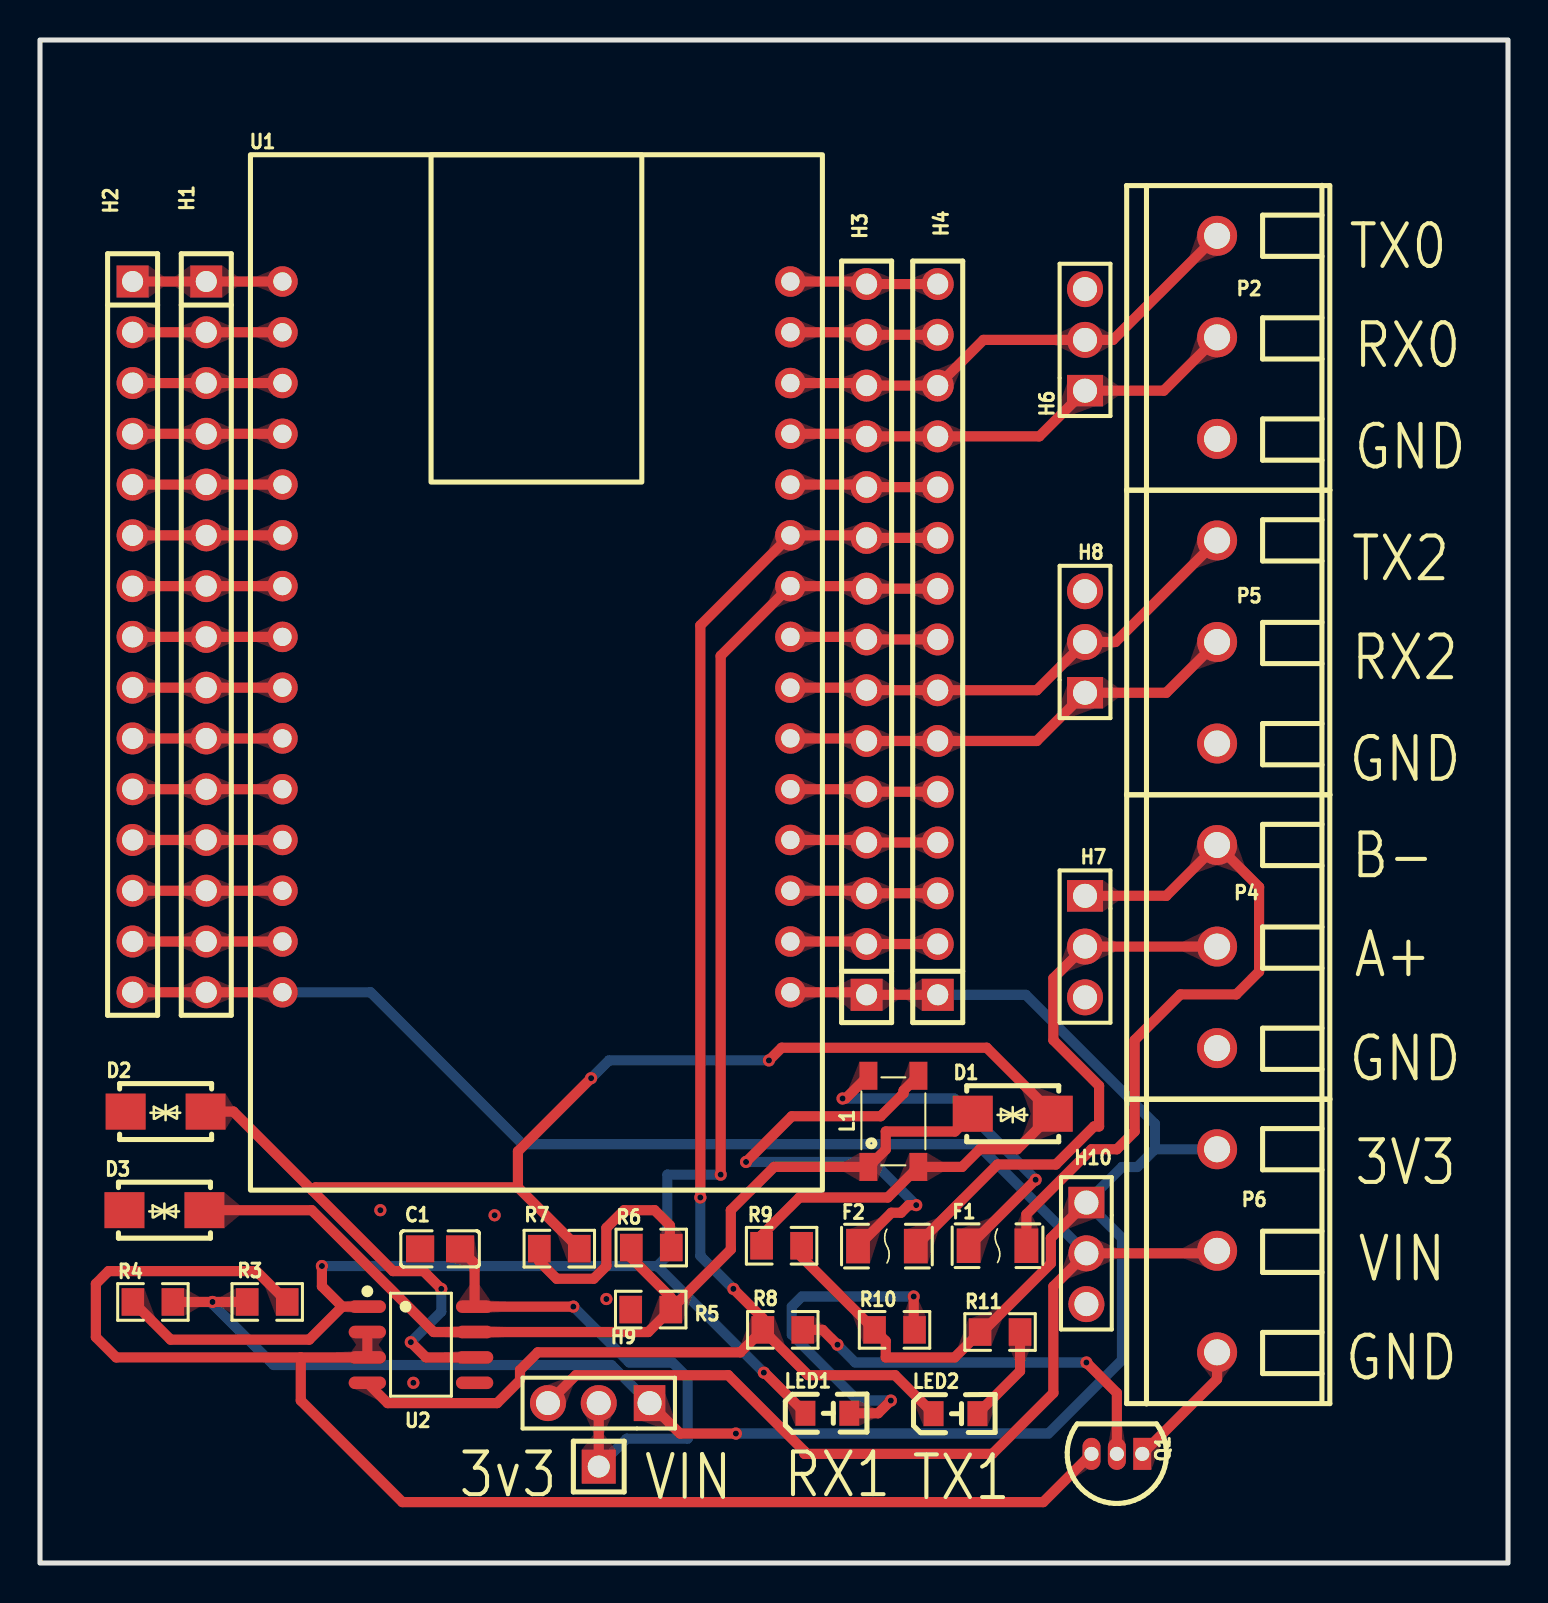
[diagram p4: board, top side]
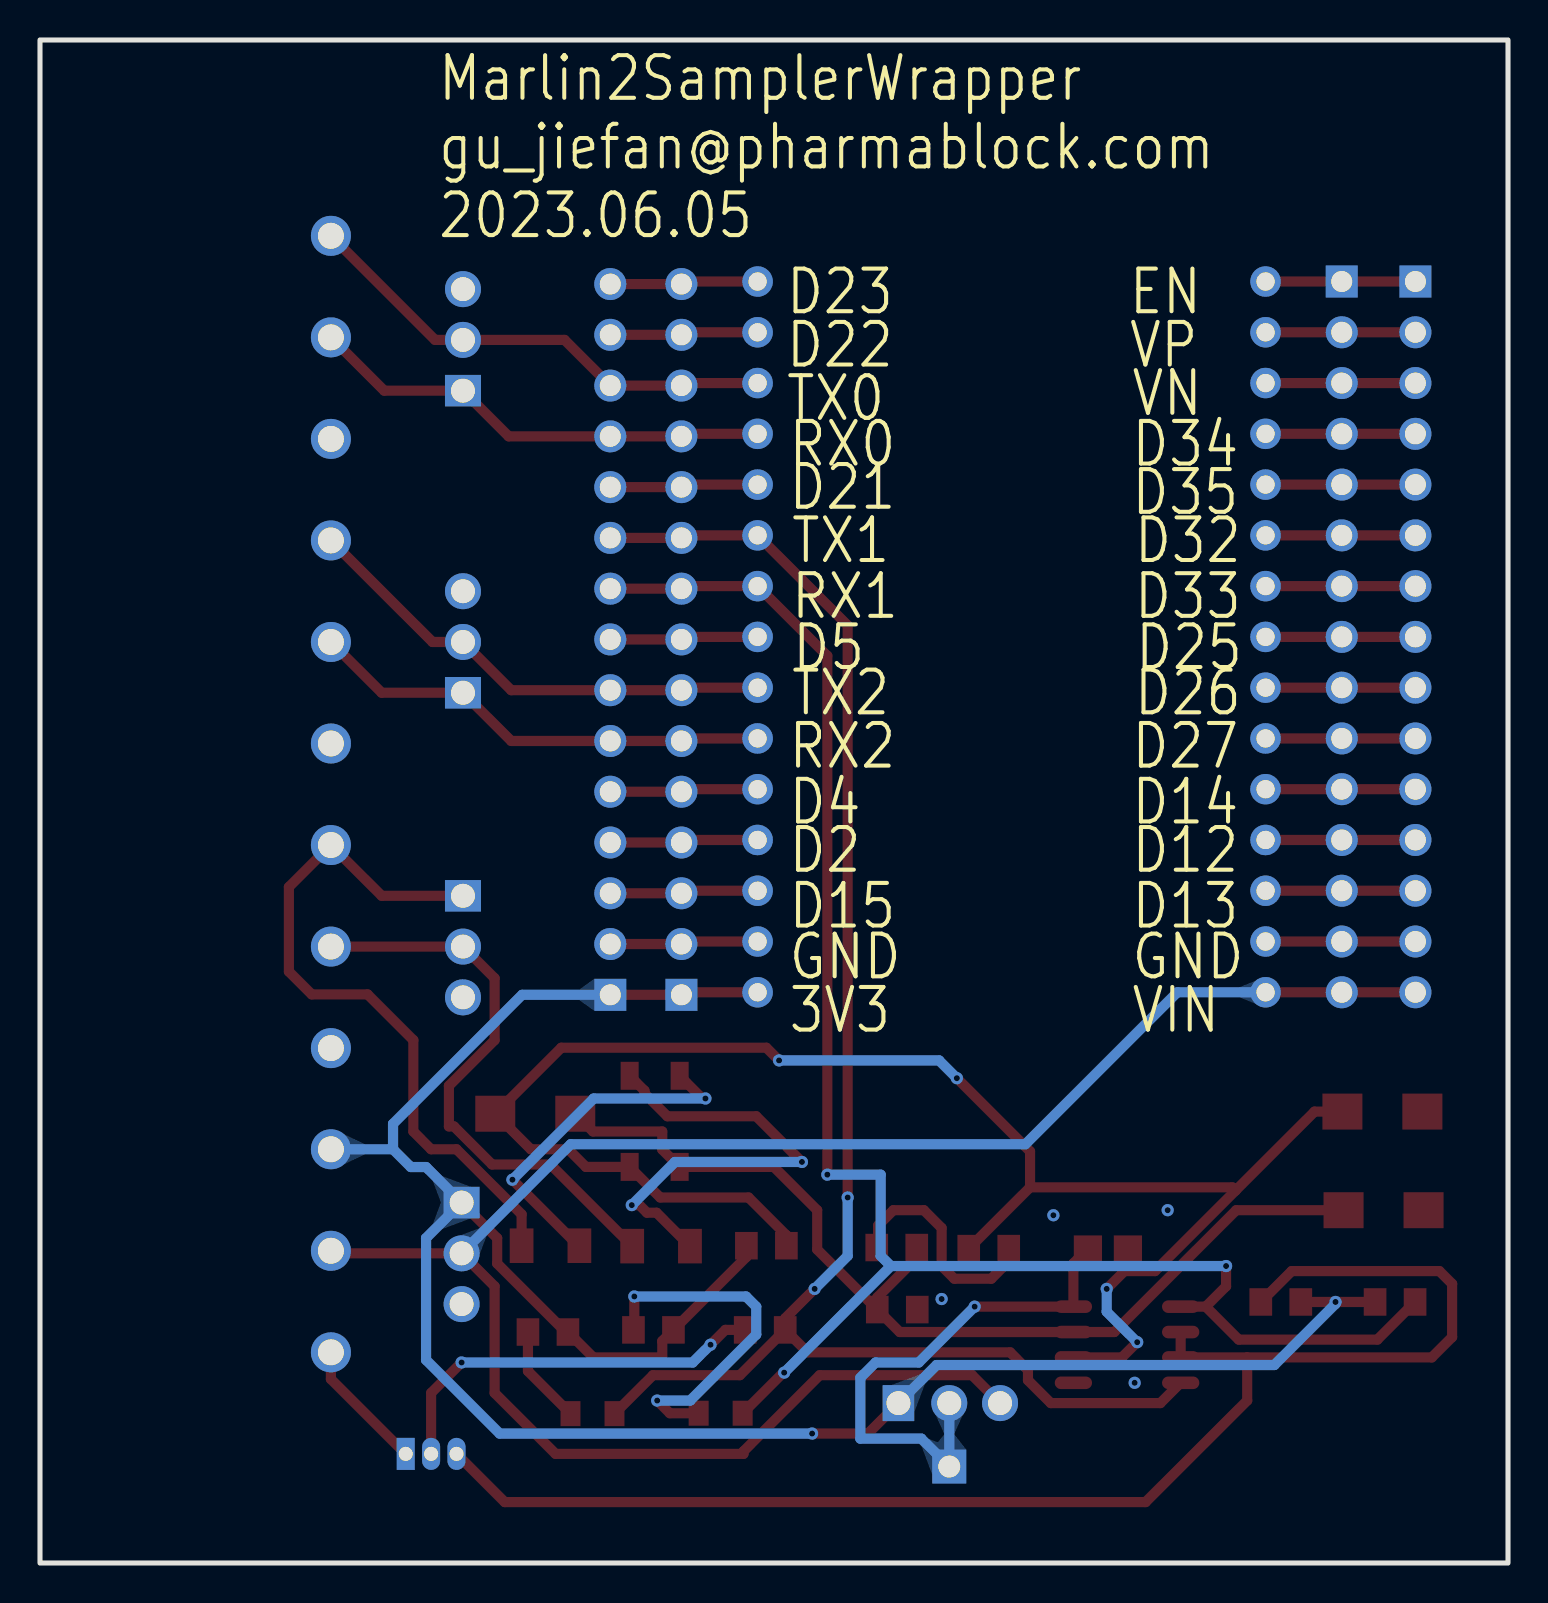
[diagram p5: board, bottom side, seen from below]

Outline 73.41 x 76.2 mm; copper layers: Top Layer, Bottom Layer. Coordinates in mm from the lower left corner of the outline.
Outline path: rectangle 0,76.2 73.41,0
Stack: Top Layer 0.035mm / Dielectric1 1.51mm FR4 er 4.5 / Bottom Layer 0.035mm

## Design rules (mm)
template: 自定义配置
spacing copperThickness1oz (default): track to track 0.152, other pairs 0.152 to 0.3
spacing copperThickness2oz: track to track 0.203, other pairs 0.152 to 0.3
track width copperThickness1oz (default): min 0.127, default 0.254, max 2.54
track width copperThickness2oz: min 0.203, default 0.254, max 2.54
differential pair differentialPair (default): width min 0.127, default 0.254, max 2.54; gap min 0.152, default 0.152
via viaSize (default): diameter min 0.5, default 0.61, max 10; hole min 0.3, default 0.305, max 6.3

## Placement (name value [footprint] x y rotation side)
C1  0.1uF  [C0805]  20.01 15.72 0 top
D1  SMAJ12CA  [SMA_L4.4-W2.6-LS5.0-BI]  48.64 22.48 0 top
D2  SMAJ6.5CA  [SMA_L4.4-W2.6-LS5.0-BI]  6.28 22.59 0 top
D3  SMAJ6.5CA  [SMA_L4.4-W2.6-LS5.0-BI]  6.22 17.65 0 top
F1  nSMD010  [F1206]  47.88 15.88 0 top
F2  nSMD010  [F1206]  42.35 15.86 0 top
H1  B-2100S15P-A110  [HDR-TH_15P-P2.54-V-M]  8.31 46.34 270 top
H2  B-2100S15P-A110  [HDR-TH_15P-P2.54-V-M]  4.63 46.34 270 top
H3  B-2100S15P-A110  [HDR-TH_15P-P2.54-V-M]  41.33 46.21 90 top
H4  B-2100S15P-A110  [HDR-TH_15P-P2.54-V-M]  44.89 46.21 90 top
H6  2.54-1*3P针  [HDR-TH_3P-P2.54-V-M-1]  52.26 61.19 90 top
H7  2.54-1*3P针  [HDR-TH_3P-P2.54-V-M-1]  52.26 30.84 270 top
H8  2.54-1*3P针  [HDR-TH_3P-P2.54-V-M-1]  52.26 46.08 90 top
H9  2.54-1*3P针  [HDR-TH_3P-P2.54-V-M-1]  27.94 8 180 top
H10  2.54-1*3P针  [HDR-TH_3P-P2.54-V-M-1]  52.32 15.49 270 top
L1  ACT45B-510-2P-TL003  [IND-SMD_4P-L4.5-W3.2-TL]  42.67 22.1 90 top
LED1  NCD0805R1  [LED0805-RD_RED]  39.37 7.49 0 top
LED2  NCD0805R1  [LED0805-RD_RED]  45.78 7.47 0 top
P2  WJ500V-5.08-3P  [CONN-TH_3P-P5.00_WJ500V-5.08-3P]  58.86 61.32 270 top
P3  2.54-1*1P针  [HDR-TH_1P-P2.54-V-M]  27.94 4.83 0 top
P4  WJ500V-5.08-3P  [CONN-TH_3P-P5.00_WJ500V-5.08-3P]  58.86 30.84 270 top
P5  WJ500V-5.08-3P  [CONN-TH_3P-P5.00_WJ500V-5.08-3P]  58.86 46.08 270 top
P6  WJ500V-5.08-3P  [CONN-TH_3P-P5.00_WJ500V-5.08-3P]  58.86 15.62 270 top
Q1  S8050  [TO-92-3_L4.9-W3.7-P1.27-L]  53.85 5.46 180 top
R3  4.7K  [R0805]  11.36 13.06 180 top
R4  4.7K  [R0805]  5.65 13.06 0 top
R5  4.7K  [R0805]  30.54 12.68 180 top
R6  120Ω  [R0805]  30.57 15.78 0 top
R7  0Ω  [R0805]  25.97 15.73 180 top
R8  4.7K  [R0805]  37.14 11.66 180 top
R9  4.7K  [R0805]  37.08 15.88 180 top
R10  1K  [R0805]  42.73 11.66 0 top
R11  1K  [R0805]  48.01 11.56 0 top
U1  -  [ESP32-devkit-30pin]  24.82 43.16 0 top
U2  GM3085E  [SOP-8_L4.9-W3.9-P1.27-LS6.0-BL]  19.05 10.92 270 top

## Footprints (pads in the part's own frame, mm; a bottom-side part is the same pattern mirrored in y, then rotated)
C0805
  rect 1.41x1.35 smd: 1(-1,0) 2(1,0)
CONN-TH_3P-P5.00_WJ500V-5.08-3P
  round 2 hole 1.3: 1(-5.08,0) 2(0,0) 3(5.08,0)
ESP32-devkit-30pin
  round 1.524 hole 0.914: 1(-12.7,20.955) 2(-12.7,18.415) 3(-12.7,15.875) 4(-12.7,13.335) 5(-12.7,10.795) 6(-12.7,8.255) 7(-12.7,5.715) 8(-12.7,3.175) 9(-12.7,0.635) 10(-12.7,-1.905) 11(-12.7,-4.445) 12(-12.7,-6.985) 13(-12.7,-9.525) 14(-12.7,-12.065) 15(-12.7,-14.605) 16(12.7,-14.605) 17(12.7,-12.065) 18(12.7,-9.525) 19(12.7,-6.985) 20(12.7,-4.445) 21(12.7,-1.905) 22(12.7,0.635) 23(12.7,3.175) 24(12.7,5.715) 25(12.7,8.255) 26(12.7,10.795) 27(12.7,13.335) 28(12.7,15.875) 29(12.7,18.415) 30(12.7,20.955)
F1206
  rect 1.19x1.728 smd: 1(-1.445,0) 2(1.445,0)
HDR-TH_1P-P2.54-V-M
  rect 1.7x1.7 hole 1.1: 1(0,0)
HDR-TH_3P-P2.54-V-M-1
  rect 1.575x1.8 hole 1.2: 1(-2.54,0)
  round 1.8 hole 1.2: 2(0,0) 3(2.54,0)
HDR-TH_15P-P2.54-V-M
  rect 1.6x1.6 hole 1.05: 1(-17.78,0)
  round 1.6 hole 1.05: 2(-15.24,0) 3(-12.7,0) 4(-10.16,0) 5(-7.62,0) 6(-5.08,0) 7(-2.54,0) 8(0,0) 9(2.54,0) 10(5.08,0) 11(7.62,0) 12(10.16,0) 13(12.7,0) 14(15.24,0) 15(17.78,0)
IND-SMD_4P-L4.5-W3.2-TL
  rect 1.4x0.9 smd: 1(-2.28,1.25) 2(-2.28,-1.25) 3(2.28,-1.25) 4(2.28,1.25)
LED0805-RD_RED
  rect 1x1.25 smd: 1(-1.1,0) 2(1.1,0)
R0805
  rect 1.133x1.377 smd: 1(-1,0) 2(1,0)
SMA_L4.4-W2.6-LS5.0-BI
  rect 2x1.8 smd: 1(-2,0) 2(2,0)
SOP-8_L4.9-W3.9-P1.27-LS6.0-BL
  oval 0.63x1.865 smd: 1(-1.905,-2.683) 2(-0.635,-2.683) 3(0.635,-2.683) 4(1.905,-2.683) 5(1.905,2.683) 6(0.635,2.683) 7(-0.635,2.683) 8(-1.905,2.683)
TO-92-3_L4.9-W3.7-P1.27-L
  rect 0.9x1.6 hole 0.7: 1(-1.27,0)
  oval 0.9x1.6 hole 0.7: 2(0,0) 3(1.27,0)

## Nets
As in the schematic.

## Via types
v1: diameter 0.61, hole 0.305, Top Layer to Bottom Layer, 29 vias

## Routing (per net, layer and track width the routed paths; a pad name or vN(x,y) marks a point on that pad's centre or on a via; arc(x,y) is an arc through that point)
3V3: length 113.3
  Top Layer w0.508: R3.2 v1(8.63,13.06) R4.2 ; v1(44.89,28.43) H3.1 41.21,28.56 U1.16 ; v1(34.8,6.48) 32,6.48 v1(30.48,8) ; R9.1 38.08,15.31 R10.1 42.29,11.1 42.29,10.29 45.74,10.29 R11.1 47.12,11.56 50.55,14.99 50.55,16.26 v1(52.32,18.03)
  Bottom Layer w0.508: 55.75,20.7 54.86,19.81 54.1,19.81 v1(52.32,18.03) 54.1,16.26 54.1,10.16 50.42,6.48 v1(34.8,6.48) ; 55.75,20.7 P6.1 ; 55.75,20.7 55.75,21.97 49.3,28.43 v1(44.89,28.43) ; v1(30.48,8) 28.58,9.91 11.68,9.91 8.63,12.96 v1(8.63,13.06)
GND: length 21.5
  Top Layer w0.508: Q1.1 58.86,9.2 P6.3 ; H4.2 H3.2 41.21,31.1 U1.17 ; U1.14 H1.14 H2.14
  vias: v1(17.02,17.65) v1(18.67,9.02) v1(22.73,17.4) v1(28.32,13.21)
VIN: length 96.2
  Top Layer w0.508: H9.3 26.8,9.4 34.42,9.4 38.23,5.59 38.23,5.46 47.62,5.46 50.67,8.51 50.67,13.84 H10.2 58.73,15.49 P6.2 ; H2.15 H1.15 v1(12.12,28.56)
  Bottom Layer w0.508: v1(12.12,28.56) 16.53,28.56 24.13,20.95 46.86,20.95 H10.2
D2: length 7.4
  Top Layer w0.508: H4.4 H3.4 41.21,36.18 U1.19
D4: length 7.4
  Top Layer w0.508: H4.5 H3.5 41.21,38.72 U1.20
D5: length 7.4
  Top Layer w0.508: U1.23 41.21,46.34 H3.8 H4.8
D12: length 7.5
  Top Layer w0.508: U1.12 H1.12 H2.12
D13: length 7.5
  Top Layer w0.508: U1.13 H1.13 H2.13
D14: length 7.5
  Top Layer w0.508: H2.11 H1.11 U1.11
D15: length 7.4
  Top Layer w0.508: U1.18 41.21,33.64 H3.3 H4.3
D21: length 7.4
  Top Layer w0.508: H4.11 H3.11 41.21,53.96 U1.26
D22: length 7.4
  Top Layer w0.508: U1.29 41.21,61.58 H3.14 H4.14
D23: length 7.4
  Top Layer w0.508: H4.15 H3.15 41.21,64.12 U1.30
D25: length 7.5
  Top Layer w0.508: U1.8 H1.8 H2.8
D26: length 7.5
  Top Layer w0.508: U1.9 H1.9 H2.9
D27: length 7.5
  Top Layer w0.508: U1.10 H1.10 H2.10
D32: length 7.5
  Top Layer w0.508: U1.6 H1.6 H2.6
D33: length 7.5
  Top Layer w0.508: H2.7 H1.7 U1.7
D34: length 7.5
  Top Layer w0.508: H2.4 H1.4 U1.4
D35: length 7.5
  Top Layer w0.508: U1.5 H1.5 H2.5
EN: length 7.5
  Top Layer w0.508: H2.1 H1.1 U1.1
RX0: length 23.4
  Top Layer w0.508: U1.27 41.21,56.5 H3.12 H4.12 49.97,56.37 H6.1 56.19,58.65 P2.2
RX1: length 88.6
  Top Layer w0.508: R4.1 6.53,11.18 13.46,11.18 15.11,12.83 ; v1(36.19,9.53) 36.24,9.53 LED1.1 ; H4.9 H3.9 41.21,48.88 U1.24 34.04,45.39 v1(34.04,19.43) ; 15.11,12.83 U2.1 ; 15.11,12.83 14.1,13.84 v1(14.1,14.86)
  Bottom Layer w0.508: 30.86,14.86 31.37,15.37 31.37,19.43 v1(34.04,19.43) ; 30.86,14.86 v1(14.1,14.86) ; 30.86,14.86 v1(36.19,9.53)
RX2: length 23.4
  Top Layer w0.508: P5.2 56.32,43.54 H8.1 49.84,41.13 H4.6 H3.6 41.21,41.26 U1.21
TX0: length 24.5
  Top Layer w0.508: P2.1 53.65,61.19 H6.2 47.18,61.19 H4.13 H3.13 41.21,59.04 U1.28
TX1: length 82.6
  Top Layer w0.508: LED2.1 42.75,9.4 38.41,9.4 R8.2 ; v1(34.67,13.72) 36.14,12.24 R8.2 ; U2.4 17.38,8 22.86,8 24,9.14 24,9.65 24.89,10.54 35.02,10.54 R8.2 ; H4.10 H3.10 41.21,51.42 U1.25 33.02,46.91 v1(33.02,18.29)
  Bottom Layer w0.508: v1(33.02,18.29) 33.02,15.37 v1(34.67,13.72)
TX2: length 24.5
  Top Layer w0.508: P5.1 53.78,46.08 H8.2 49.84,43.67 H4.7 H3.7 41.21,43.8 U1.22
VN: length 7.5
  Top Layer w0.508: U1.3 H1.3 H2.3
VP: length 7.5
  Top Layer w0.508: U1.2 H1.2 H2.2
$1N2909: length 73.2
  Top Layer w0.508: 13.04,10.29 U2.3 U2.2 ; 13.04,10.29 13.04,8.13 18.12,3.05 50.16,3.05 Q1.3 ; 13.04,10.29 3.81,10.29 2.79,11.3 2.79,13.97 3.43,14.6 10.82,14.6 R3.1
$1N4480: length 20.1
  Top Layer w0.508: v1(39.88,10.92) 39.14,11.66 R8.1 ; v1(52.32,10.03) 53.85,8.51 Q1.2
  Bottom Layer w0.508: v1(39.88,10.92) 40.77,10.03 v1(52.32,10.03)
$1N4547: length 11.5
  Top Layer w0.508: R6.2 31.5,15.85 31.5,16.89 30.73,17.65 29.21,17.65 28.32,16.76 28.32,14.86 27.69,14.22 25.84,14.22 24.97,15.09 R7.2
$1N4912: length 28.8
  Top Layer w0.508: P4.2 H7.2 50.67,29.26 50.67,26.16 52.96,23.88 52.96,21.84 52.71,21.84 50.8,19.94 47.88,19.94 F2.2
$1N4918: length 35.8
  Top Layer w0.508: H7.1 56.32,33.38 P4.1 60.96,33.82 60.96,29.59 59.82,28.45 57.02,28.45 54.74,26.16 54.74,21.59 53.85,20.7 52.58,20.7 49.32,17.45 F1.2
$1N5168: length 29.7
  Top Layer w0.508: C1.2 21.73,14.99 U2.8 v1(26.67,12.83) ; v1(27.94,8) P3.1
  Bottom Layer w0.508: v1(27.94,8) P3.1 29.34,6.22 32.38,6.22 32.38,9.27 31.62,10.03 29.46,10.03 v1(26.67,12.83)
$1N5254: length 51.1
  Top Layer w0.508: R5.1 34.54,15.69 34.54,17.65 36.71,19.82 L1.1 42.29,20.69 42.29,21.59 45.75,21.59 D1.1 ; R5.1 30.41,11.56 U2.7 19.69,11.56 13.59,17.65 D3.2 ; R5.1 31.54,13.29 29.57,15.27 R6.1
$1N5258: length 86.6
  Top Layer w0.508: D2.2 9.67,22.59 13.62,18.63 ; 13.62,18.63 13.78,18.8 23.9,18.8 ; 13.62,18.63 17.65,14.6 19.18,14.6 v1(20.07,13.72) ; v1(36.45,25.15) 37.08,25.78 47.34,25.78 D1.2 48.86,20.7 46.99,20.7 46.11,19.82 L1.2 42.39,18.29 37.97,18.29 36.08,16.4 R9.2 ; R7.1 23.9,18.8 ; 23.9,18.8 23.9,20.6 v1(27.56,24.26) ; U2.6 19.3,10.29 v1(18.54,11.05)
  Bottom Layer w0.508: v1(18.54,11.05) 20.07,12.57 v1(20.07,13.72) ; v1(36.45,25.15) 28.45,25.15 v1(27.56,24.26)
$1N5262: length 17.8
  Top Layer w0.508: v1(49.78,19.18) 46.48,15.88 F1.1 ; v1(40.13,23.24) 40.28,23.24 L1.4
  Bottom Layer w0.508: v1(40.13,23.24) 45.72,23.24 v1(49.78,19.18)
$1N5266: length 23.6
  Top Layer w0.508: v1(43.81,17.91) 43.43,17.91 43.05,17.53 42.58,17.53 F2.1 ; v1(35.31,20.07) 37.59,22.35 42.04,22.35 43.18,23.49 43.18,23.64 L1.3
  Bottom Layer w0.508: v1(43.81,17.91) 41.66,20.07 v1(35.31,20.07)
$1N5324: length 5
  Top Layer w0.508: R11.2 49.01,9.6 LED2.2
$1N5326: length 18.1
  Top Layer w0.508: v1(42.55,8.13) 41.91,7.49 LED1.2 ; R10.2 43.69,11.71 v1(43.69,13.34)
  Bottom Layer w0.508: v1(43.69,13.34) 38.1,13.34 37.59,12.83 37.59,11.43 40.89,8.13 v1(42.55,8.13)

## Copper pours and planes (outline as drawn; the poured copper is in the pictures)
GND on Top Layer: 2.62,70.48 67.82,70.48 67.82,3.25 2.67,3.25 2.67,5.72
GND on Bottom Layer: 2.6,70.48 67.82,70.48 67.82,3.28 2.67,3.28

Small or netless copper shapes (teardrops, artwork), in the pictures only: 201 on Top Layer, 10 on Bottom Layer

## Text on the board
Bottom Silkscreen Layer: D25 | D32 | D33 | D26 | VN | D34 | D35 | D27 | D14 | D12 | D13 | GND | VIN | EN | VP | D5 | TX1 | RX1 | TX2 | RX0 | D21 | RX2 | D4 | D2 | D15 | 3V3 | D23 | D22 | TX0 | Marlin2SamplerWrapper / gu_jiefan@pharmablock.com / 2023.06.05
Top Silkscreen Layer: 3v3 | VIN | GND | TX0 | TX2 | RX2 | B- | RX0 | A+ | 3V3 | RX1 | TX1
